# EAGLE design rat (EAGLE 7.6.0)
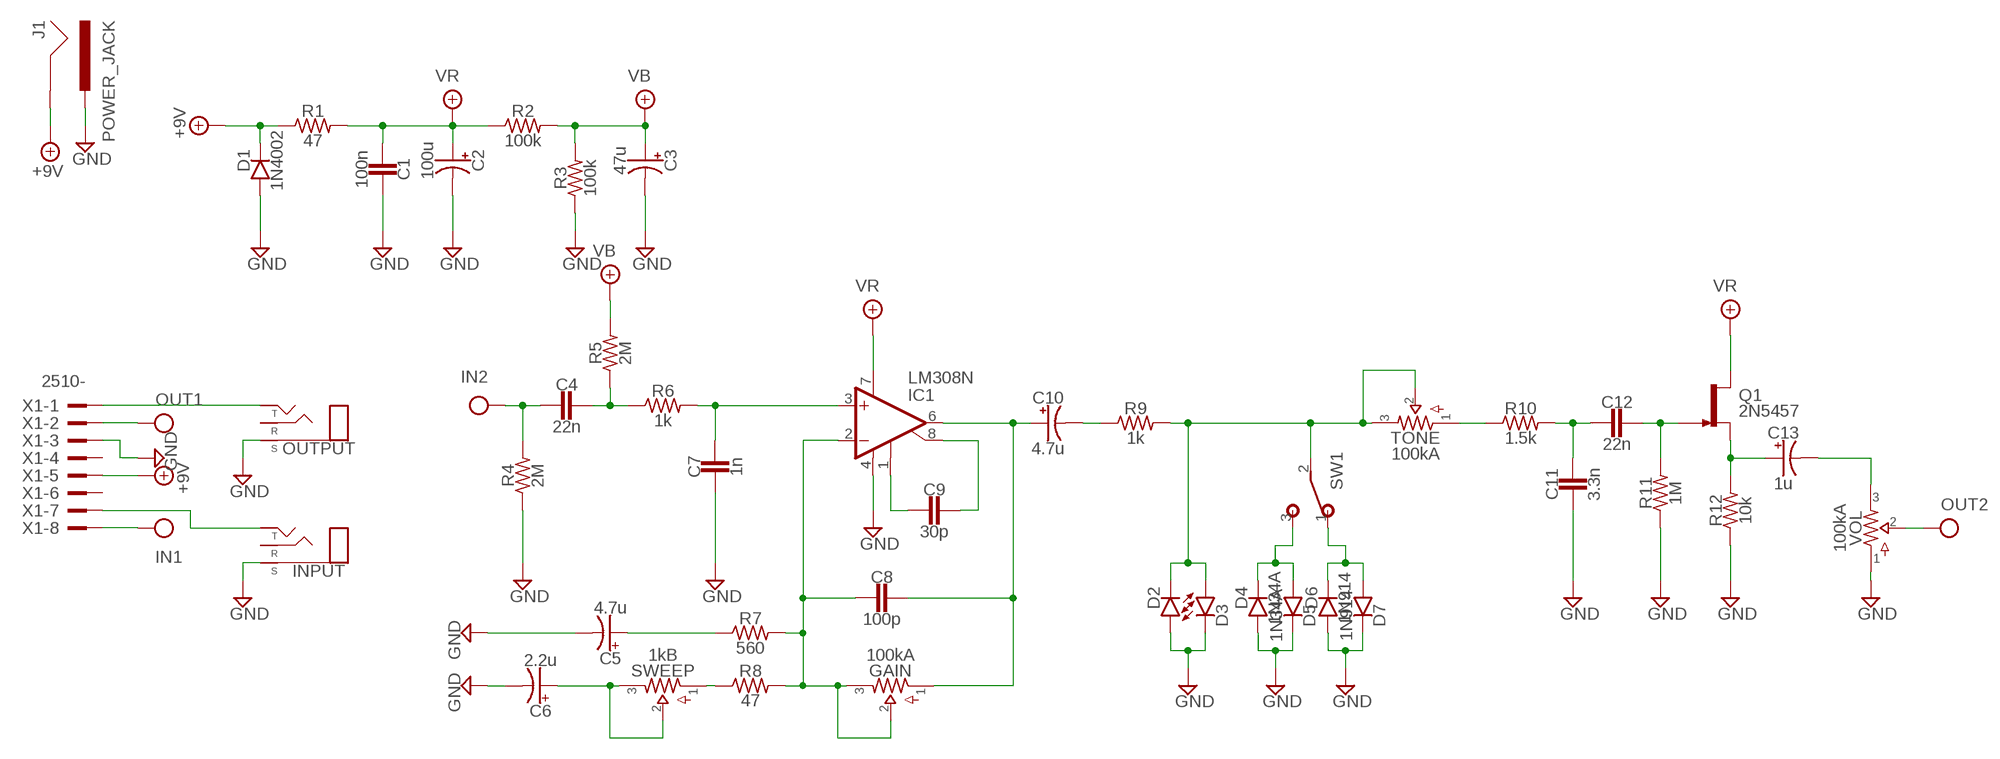
[diagram p0: schematic, sheet 1]

## Parts
C1  100n  CER/FILM2  [050X030_025_2]
C2  100u  0400  [040_020]
C3  47u  0400  [040_020]
C4  22n  CER/FILMBOX.1  [BOX_SMALL]
C5  4.7u  0500  [050_020]
C6  2.2u  0500  [050_020]
C7  1n  CER/FILMBOX.1  [BOX_SMALL]
C8  100p  CER/FILM2  [050X030_025_2]
C9  30p  CER/FILM2  [050X030_025_2]
C10  4.7u  0500  [050_020]
C11  3.3n  CER/FILMBOX.1  [BOX_SMALL]
C12  22n  CER/FILMBOX.1  [BOX_SMALL]
C13  1u  0500  [050_020]
D1  1N4002  DO41.2  [DO41-2]
D2  LED  [3MM_D]
D3  LED  [3MM_D]
D4  1N34A  DO35.2  [DO35-2]
D5  1N34A  DO35.2  [DO35-2]
D6  1N914  DO35.2  [DO35-2]
D7  1N914  DO35.2  [DO35-2]
GAIN  100kA  POTS16MM  [16MM]
IC1  LM308N  [DIL08]
INPUT  STEREONMJ  [NMJ6HCD2]
J1  POWER_JACK  [POWER_JACK_PTH]
OUTPUT  STEREONMJ  [NMJ6HCD2]
Q1  2N5457  [TO92-]
R1  47  R_.3B  [R0207/3]
R2  100k  R_.3B  [R0207/3]
R3  100k  R_.3B  [R0207/3]
R4  2M  R_.3B  [R0207/3]
R5  2M  R_.3B  [R0207/3]
R6  1k  R_.3B  [R0207/3]
R7  560  R_.3B  [R0207/3]
R8  47  R_.3B  [R0207/3]
R9  1k  R_.3B  [R0207/3]
R10  1.5k  R_.3B  [R0207/3]
R11  1M  R_.3B  [R0207/3]
R12  10k  R_.3B  [R0207/3]
SW1  SPDT  [M9040P]
SWEEP  1kB  POTS16MM  [16MM]
TONE  100kA  POTS16MM  [16MM]
VOL  100kA  POTS16MM  [16MM]
X1  2510-  [PAK100/2500-10]

## Nets
+9V: D1.C J1.GND R1.1 X1.5
GND: C1.1 C2.- C3.- C5.- C6.- C7.2 C11.2 D1.A D2.ANODE(A) D3.P$1(C) D4.A D5.C D6.A D7.C IC1.4(V-) INPUT.S J1.PWR OUTPUT.S R3.1 R4.1 R11.1 R12.1 VOL.1 X1.3
IN: C4.2 R4.2 X1.8
N$1: INPUT.T X1.7
N$2: C4.1 R5.1 R6.1
N$3: C7.1 IC1.3(+IN) R6.2
N$4: OUTPUT.T X1.1
N$5: R8.1 SWEEP.1
N$6: C9.2 IC1.1(CMP1)
N$7: C9.1 IC1.8(CMP2)
N$8: C8.1 C10.+ GAIN.1 IC1.6(OUT)
N$9: C5.+ R7.1
N$10: C6.+ SWEEP.2 SWEEP.3
N$11: C10.- R9.1
N$12: D2.P$1(C) D3.ANODE(A) R9.2 SW1.2(P) TONE.2 TONE.3
N$13: C8.2 GAIN.2 GAIN.3 IC1.2(-IN) R7.2 R8.2
N$14: R10.1 TONE.1
N$15: C11.1 C12.2 R10.2
N$16: C12.1 Q1.1(G) R11.2
N$17: C13.+ Q1.2(S) R12.2
N$18: C13.- VOL.3
N$20: D4.C D5.A SW1.3(S)
N$21: D6.C D7.A SW1.1(O)
OUT: VOL.2 X1.2
VB: C3.+ R2.2 R3.2 R5.2
VR: C1.2 C2.+ IC1.7(V+) Q1.3(D) R1.2 R2.1
Unconnected: INPUT.R OUTPUT.R X1.4 X1.6

## Library data of the parts
C1 C4 C7-C9 C11 C12 = pedals-capacitors-film:CER/FILM: 47 - 120pF Xicon Ceramic Disc 2.5mm lead spacing
C2 C3 = pedals-capacitors-elec:040
C5 C6 C10 C13 = pedals-capacitors-elec:050
D1 = pedals-diodes:DO41: DO-41 Package Diodes: 1N4001 - 1N40019 Zener Diodes: 1N4728 - 1N4764
D2 D3 = pedals-diodes:LED
D4-D7 = pedals-diodes:DO35: DO-35 Package Diodes: 1N914
GAIN SWEEP TONE VOL = pedals-potentiometers:POTS
IC1 = pedals-integrated circuits:LM308: OP AMP
INPUT OUTPUT = pedals-jacks:STEREO
J1 = pedals-jacks:POWER_JACK: Power Jack Connector This is the standard 5.5mm barrel jack for power. The PTH is the most common, proven, reliable, footprint. The Slot footprint only works if the mill layer is transmitted to the PCB fab house so be warned. Here are the connectors we sell at SparkFun: DC Barrel Power Jack/Connector <https://www.sparkfun.com/products/119> (PRT-00119) DC Barrel Power Jack/Connector (SMD) <https://www.sparkfun.com/products/12748> (PRT-12748) DC Barrel Jack Adapter - Breadboard Compatible <https://www.sparkfun.com/products/10811> (PRT-10811) It is used on this SparkFun product (and many, many others): SparkFun RedBoard - Programmed with Arduino <https://www.sparkfun.com/products/12757> (DEV-12757) Also, if you need a mating power supply or connector, please check these out: Wall Adapter Power Supply - 9VDC 650mA <https://www.sparkfun.com/products/298> (TOL-00298) DC Barrel Jack Adapter - Male <https://www.sparkfun.com/products/10287> (PRT-10287); PROD_ID: CONN-08197
Q1 = pedals-transistors:2N5457: N-CHANNEL JFET
R1-R12 = pedals-resistors:R_
SW1 = pedals-switches:SPDT: TOGGLE SWITCH Marquardt
X1 = pedals-headers:2510-: 3M (TM) Pak 100 4-Wall Header Source: 3M; MF: 3M; MPN: 2510-6002UB; OC_FARNELL: 9838244; OC_NEWARK: 46F4725

## Board
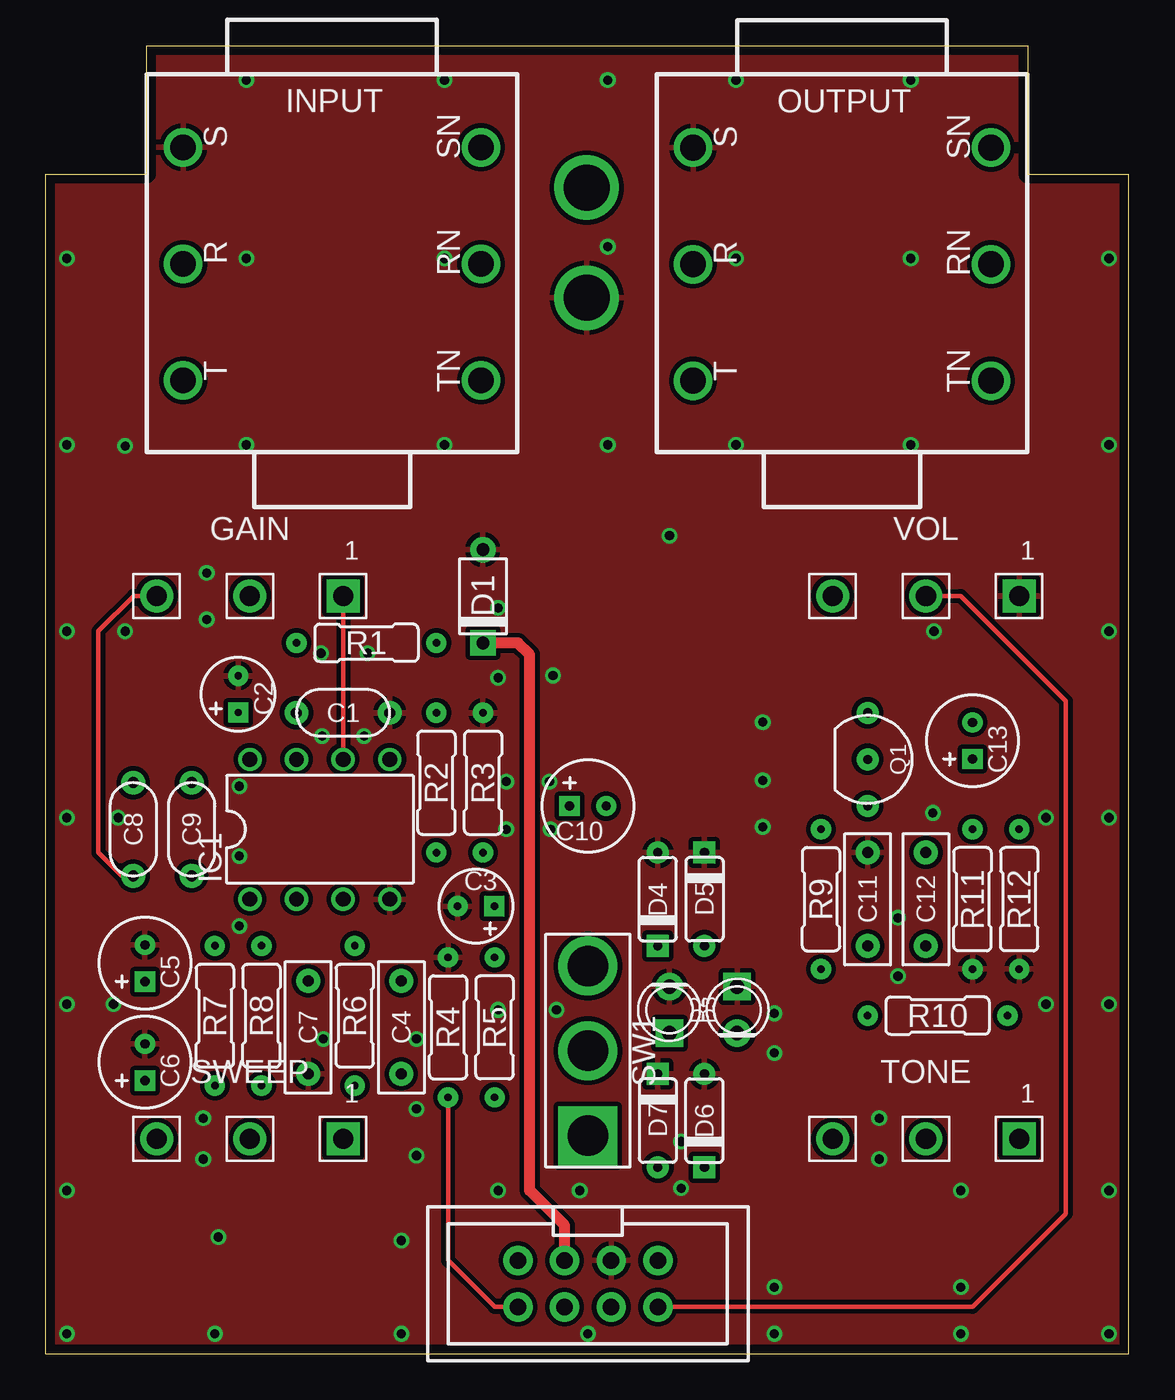
[diagram p1: board, top side]
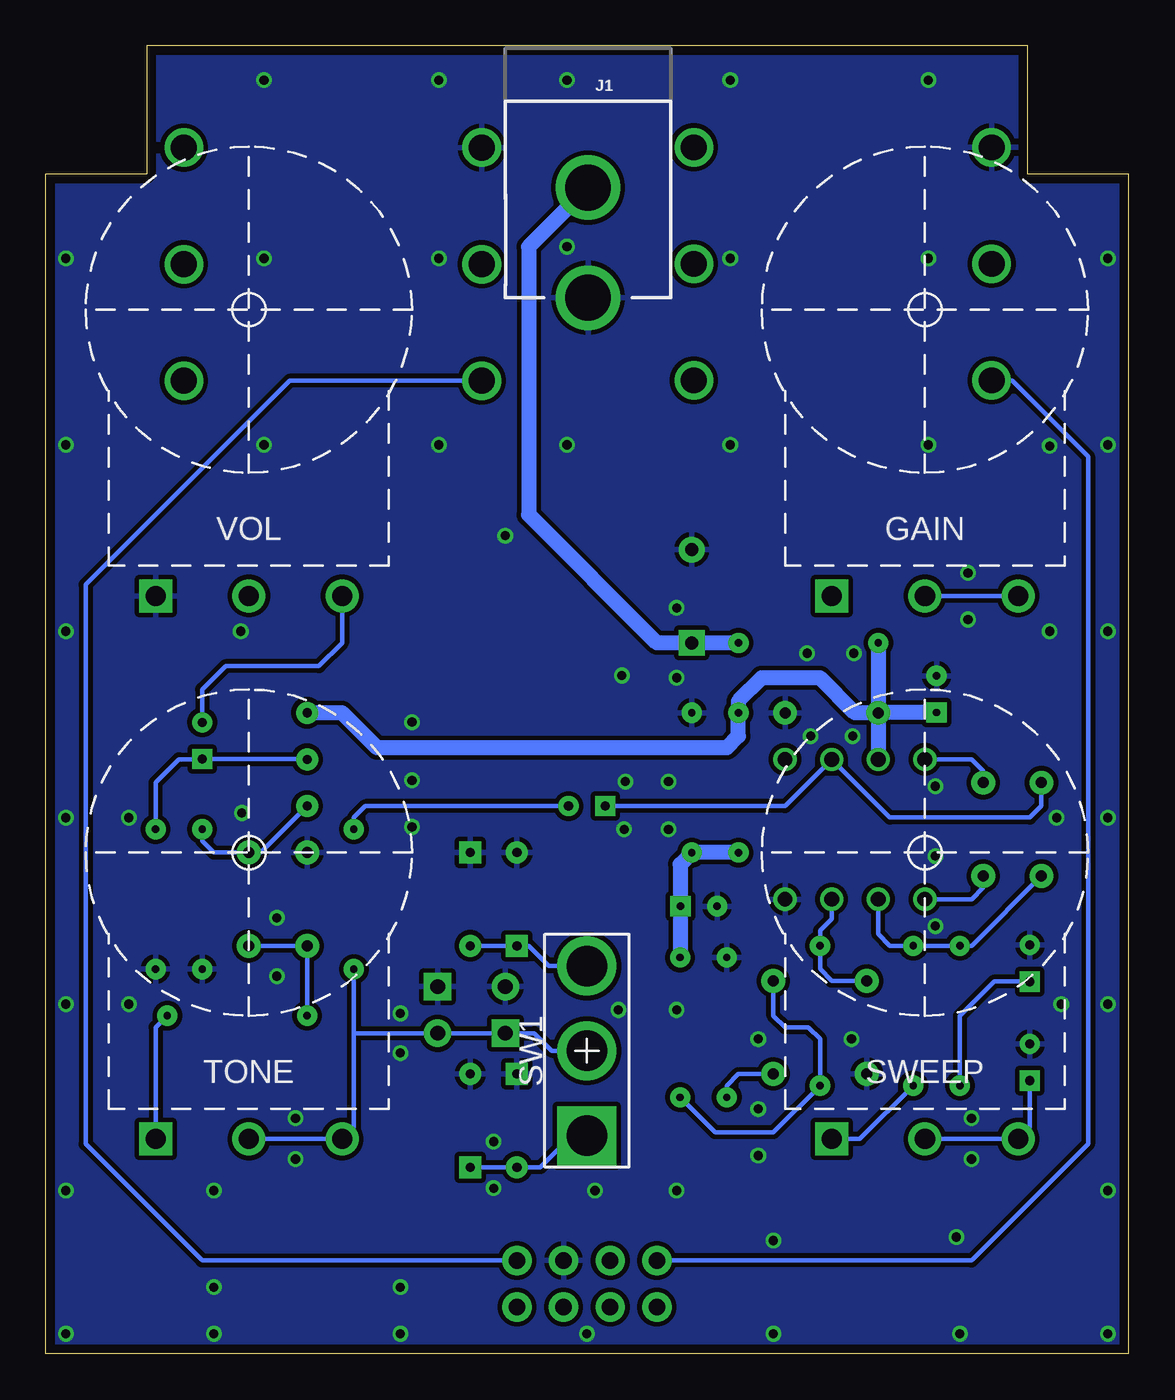
[diagram p2: board, bottom side, seen from below]

Size 59 x 71.27 mm. Coordinates in mm from the lower left corner, seen from the top.
Copper layers (1*16): Top 0.035mm / dielectric 1.6mm / Bottom 0.035mm
Design rules "Elecrow_2-layer_PCB_eagle_rule": minimum track width 6mil, minimum drill 12mil, track to track 6mil, track to pad 6mil, pad to pad 6mil, via to via 8mil, smd to smd 0mil, copper to edge 20mil, drill to drill 10mil, minimum pad ring 6mil, minimum via ring 6mil, stop-mask expansion 0mil, vias tented up to drill 100mil, thermal gap 10mil

### Footprints (pad centres in the part's own frame; a part is rotated, then mirrored left to right if it is on the bottom)
050X030_025_2 = drill 0.6 pad 1.3: 1 -2.54,0; 2 2.54,0
040_020 = drill 0.4 pad 1.1 square: + -1.001,0 | drill 0.4 pad 1.1: - 1.001,0
BOX_SMALL = drill 0.6 pad 1.3: 1 -2.54,0; 2 2.54,0
050_020 = drill 0.5 pad 1.1 square: + -0.998,0.001 | drill 0.5 pad 1.1: - 0.998,0.001
DO41-2 = drill 0.7 pad 1.4: A 2.54,0 | drill 0.7 pad 1.4 square: C -2.54,0
3MM_D = drill 0.8 pad 1.5 square: ANODE -1.27,0 | drill 0.8 pad 1.5: P$1 1.27,0
DO35-2 = drill 0.5 pad 1.2: A 2.54,0 | drill 0.5 pad 1.2 square: C -2.54,0
16MM = drill 1.1 pad 1.8 square: 1 5.08,-1 | drill 1.1 pad 1.8: 2 0,-1; 3 -5.08,-1
DIL08 = drill 0.813 pad 1.27: 1 -3.81,-3.81; 2 -1.27,-3.81; 3 1.27,-3.81; 4 3.81,-3.81; 5 3.81,3.81; 6 1.27,3.81; 7 -1.27,3.81; 8 -3.81,3.81
NMJ6HCD2 = drill 1.4: R 0,8.115; RN 0,-8.115; S 6.35,8.115; SN 6.35,-8.115; T -6.35,8.115; TN -6.35,-8.115
POWER_JACK_PTH = drill 2.5: GND 0,7.7; PWR 0,13.7
TO92- = drill 0.5 pad 1.2: 1 2.54,0; 2 0,0; 3 -2.54,0
R0207/3 = drill 0.4 pad 1.1: 1 -3.81,0; 2 3.81,0
M9040P = drill 2.2 pad 2.9 square: 1 4.636,0 | drill 2.2 pad 2.9: 2 0,0; 3 -4.61,0
PAK100/2500-10 = drill 0.9 pad 1.6: 1 -3.81,-1.27; 2 -3.81,1.27; 3 -1.27,-1.27; 4 -1.27,1.27; 5 1.27,-1.27; 6 1.27,1.27; 7 3.81,-1.27; 8 3.81,1.27

### Placement (x,y rotation side)
C1  16.19,34.93 180 top
C2  10.48,35.94 90 top
C3  23.43,24.38 180 top
C4  19.37,17.78 270 top
C5  5.4,21.27 90 top
C6  5.4,15.88 90 top
C7  14.29,17.78 270 top
C8  4.76,28.57 270 top
C9  7.94,28.57 270 top
C10  29.53,29.84 0 top
C11  44.77,24.77 90 top
C12  47.94,24.77 270 top
C13  50.48,33.4 90 top
D1  23.81,41.28 90 top
D2  37.66,18.73 270 top
D3  33.97,18.73 90 top
D4  33.34,24.77 90 top
D5  35.88,24.77 270 top
D6  35.88,12.7 90 top
D7  33.34,12.7 270 top
GAIN  11.11,42.29 0 top
IC1  14.92,28.57 0 top
INPUT  15.59,59.39 90 top
J1  29.46,71.25 180 bottom
OUTPUT  43.37,59.37 90 top
Q1  44.77,32.38 270 top
R1  17.46,38.74 180 top
R2  21.27,31.11 270 top
R3  23.81,31.11 270 top
R4  21.91,17.78 270 top
R5  24.45,17.78 90 top
R6  16.83,18.41 90 top
R7  9.21,18.41 90 top
R8  11.75,18.41 90 top
R9  42.23,24.77 270 top
R10  48.58,18.41 180 top
R11  50.48,24.77 90 top
R12  53.02,24.77 90 top
SW1  29.53,16.51 270 top
SWEEP  11.11,12.7 0 top
TONE  47.94,12.7 0 top
U$1  [125B_PCB]  0,1.27 0 top
VOL  47.94,42.29 0 top
X1  29.53,3.81 180 top

### Tracks (layer width: path | path; a pad name or v marks a point on that pad's centre or on a via)
+9V
  Top 0.61: X1.5 28.26,6.98 26.35,8.89 26.35,38.1 25.72,38.74 D1.C
  Bottom 0.61: J1.GND 29.46,63.56
  Bottom 0.813: R1.1 D1.C 25.72,38.74 32.7,45.72 32.7,60.33 29.46,63.56
GND  (via drill 0.5 pad 0.85)
  other vias: 57.91,59.69 57.91,49.53 10.92,69.41 21.72,69.41 30.61,69.41 1.14,49.53 10.92,59.69 10.92,49.53 21.72,59.69 21.72,49.53 30.61,60.33 30.61,49.53 37.59,69.41 47.12,69.41 37.59,59.69 37.59,49.53 47.12,59.69 47.12,49.53 57.91,39.37 57.91,29.21 57.91,19.05 57.91,8.89 57.91,1.08 49.85,1.08 39.69,1.08 29.53,1.08 19.37,1.08 9.21,1.08 1.14,1.08 1.14,59.69 1.14,39.37 1.14,29.21 1.14,19.05 1.14,8.89 39.69,3.62 49.85,3.62 45.4,10.6 45.4,12.83 4.32,49.47 4.32,39.37 20.19,17.14 20.19,13.33 20.19,10.79 25.08,31.18 24.64,36.83 24.64,40.64 17.53,38.16 15.05,33.66 34.61,9.02 34.61,11.56 39.69,16.38 39.69,18.54 39.05,28.7 39.05,31.24 39.05,34.42 27.43,31.18 27.62,36.96 24.64,8.89 29.08,8.89 24.64,18.73 27.81,18.73 3.94,29.21 3.68,19.05 9.4,6.35 19.37,6.16 25.08,28.57 15.11,17.14 10.54,23.3 8.57,10.6 8.57,12.83 33.97,44.58 46.42,20.57 46.42,23.75 48.32,29.46 14.99,38.16 17.34,33.66 10.54,27.11 10.54,30.92 27.5,28.57 48.39,39.37 54.48,29.21 54.48,19.05 8.76,40.01 8.76,42.55 49.85,8.89
  pour Bottom (isolate 0.254): 0.32,71.12 59.37,71.12 58.74,-1.27 0.32,-1.27
  pour Top (isolate 0.254): 0.32,0 59.37,0 59.37,71.12 -0.32,71.12 -0.32,0
IN
  Top 0.254: X1.8 24.45,2.54 21.91,5.08 R4.2
  Bottom 0.254: R4.2 21.91,14.61 21.27,15.24 C4.2
N$1
  Bottom 0.254: INPUT.T 6.37,53.04 2.22,48.9 2.22,11.43 8.57,5.08 X1.7
N$2
  Bottom 0.254: C4.1 19.37,18.41 18.73,17.78 17.46,17.78 16.83,17.14 R6.1 19.37,12.06 22.54,12.06 R5.1
N$3
  Bottom 0.254: C7.1 16.19,20.32 16.83,20.95 R6.2 16.83,23.05 16.19,23.69 IC1.3
N$4
  Bottom 0.254: X1.1 50.48,5.08 56.83,11.43 56.83,41.91 45.72,53.02 OUTPUT.T
N$5
  Bottom 0.254: SWEEP.1 14.65,11.7 R8.1
N$6
  Bottom 0.254: C9.2 7.94,25.4 8.57,24.77 IC1.1
N$7
  Bottom 0.254: C9.1 7.94,31.75 8.57,32.38 IC1.8
N$8
  Top 0.254: GAIN.1 IC1.6
  Bottom 0.254: C8.1 4.76,29.84 5.4,29.21 13.02,29.21 IC1.6 18.73,29.84 C10.+
N$9
  Bottom 0.254: C5.+ 7.35,20.27 9.21,18.41 R7.1
N$10
  Bottom 0.254: SWEEP.2 SWEEP.3 5.4,12.34 C6.+
N$11
  Bottom 0.254: C10.- 41.59,29.85 42.23,29.21 R9.1
N$12
  Bottom 0.254: SW1.2 31.43,16.51 32.39,17.46 D3.ANODE D2.P$1 42.23,17.46 | R9.2 42.23,17.46 | 42.23,17.46 42.23,12.33 TONE.3 TONE.2
N$13
  Top 0.254: C8.2 4.13,26.04 2.86,27.3 2.86,39.37 4.78,41.29 GAIN.3
  Bottom 0.254: GAIN.3 GAIN.2 | C8.2 8.57,22.22 R7.2 R8.2 13.02,22.22 13.65,22.86 IC1.2
N$14
  Bottom 0.254: R10.1 53.02,17.78 TONE.1
N$15
  Bottom 0.254: R10.2 C11.1 C12.2
N$16
  Bottom 0.254: R11.2 50.48,27.94 49.85,27.3 C12.1 47.31,27.3 Q1.1
N$17
  Bottom 0.254: R12.2 53.02,31.11 51.75,32.38 50.5,32.38 C13.+ 44.79,32.4 Q1.2
N$18
  Bottom 0.254: VOL.3 42.86,38.74 44.13,37.47 49.21,37.47 50.48,36.2 C13.-
N$20
  Bottom 0.254: SW1.3 31.6,21.12 32.7,22.22 D4.C D5.A
N$21
  Bottom 0.254: SW1.1 30.35,11.87 32.07,10.16 D7.A D6.C
OUT
  Top 0.254: VOL.2 49.83,41.29 55.56,35.56 55.56,7.62 50.48,2.54 X1.2
VB
  Bottom 0.61: 24.45,24.14 C3.+ | 24.43,21.61 R5.2
  Bottom 0.813: R2.2 R3.2 24.45,26.67 24.45,24.14 | C3.+ 24.43,21.61
VR
  Bottom 0.61: 13.64,34.94 C1.2
  Bottom 0.813: C2.+ 13.64,34.94 | R1.2 C1.2 | C1.2 IC1.7 | C1.2 14.92,34.93 16.83,36.83 20,36.83 21.27,35.56 R2.1 21.27,33.66 21.91,33.02 40.96,33.02 42.86,34.93 Q1.3